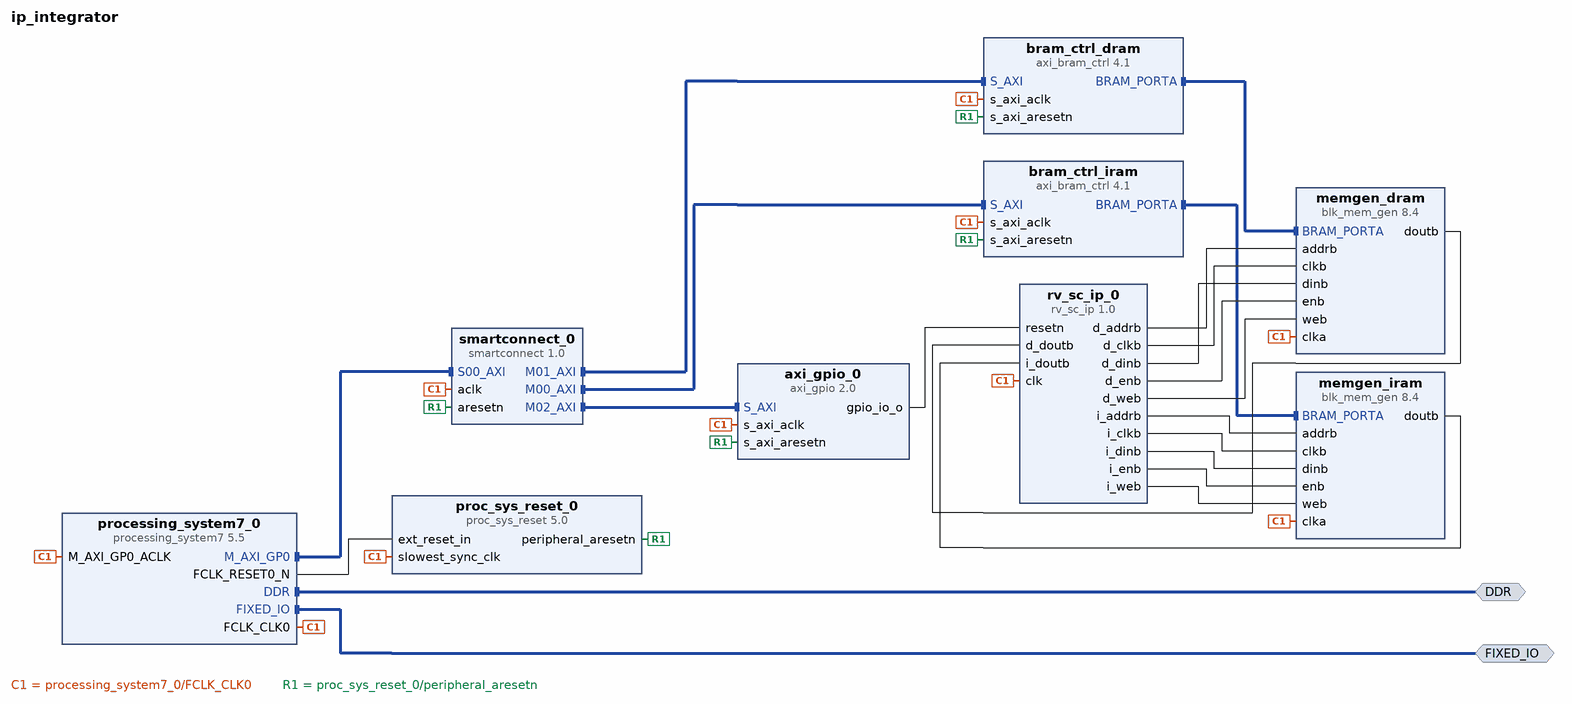
[diagram p0: block diagram of the top level]
# Vivado block design ip_integrator, xc7z020clg400-1, Vivado 2021.2
create_bd_design ip_integrator

create_bd_intf_port -mode Master -vlnv xilinx.com:interface:ddrx_rtl:1.0 DDR
create_bd_intf_port -mode Master -vlnv xilinx.com:display_processing_system7:fixedio_rtl:1.0 FIXED_IO

create_bd_cell -type ip -vlnv xilinx.com:ip:processing_system7:5.5 processing_system7_0
# 2 more settings of processing_system7_0 are not shown: defaults, MIO pin electricals, DDR timing, and values the tool derives
create_bd_cell -type ip -vlnv xilinx.com:ip:smartconnect:1.0 smartconnect_0
set_property -dict {CONFIG.NUM_MI 3 CONFIG.NUM_SI 1} [get_bd_cells smartconnect_0]
create_bd_cell -type ip -vlnv xilinx.com:ip:axi_bram_ctrl:4.1 bram_ctrl_iram
set_property -dict {CONFIG.SINGLE_PORT_BRAM 1} [get_bd_cells bram_ctrl_iram]
create_bd_cell -type ip -vlnv xilinx.com:ip:axi_bram_ctrl:4.1 bram_ctrl_dram
set_property -dict {CONFIG.SINGLE_PORT_BRAM 1} [get_bd_cells bram_ctrl_dram]
create_bd_cell -type ip -vlnv xilinx.com:ip:blk_mem_gen:8.4 memgen_iram
set_property -dict [list \
  CONFIG.Enable_B Use_ENB_Pin \
  CONFIG.Memory_Type True_Dual_Port_RAM \
  CONFIG.Port_B_Clock 100 \
  CONFIG.Port_B_Enable_Rate 100 \
  CONFIG.Port_B_Write_Rate 50 \
  CONFIG.Use_RSTB_Pin true \
] [get_bd_cells memgen_iram]
create_bd_cell -type ip -vlnv xilinx.com:ip:blk_mem_gen:8.4 memgen_dram
set_property -dict [list \
  CONFIG.Enable_B Use_ENB_Pin \
  CONFIG.Memory_Type True_Dual_Port_RAM \
  CONFIG.Port_B_Clock 100 \
  CONFIG.Port_B_Enable_Rate 100 \
  CONFIG.Port_B_Write_Rate 50 \
  CONFIG.Use_RSTB_Pin true \
] [get_bd_cells memgen_dram]
create_bd_cell -type ip -vlnv xilinx.com:ip:axi_gpio:2.0 axi_gpio_0
set_property -dict {CONFIG.C_ALL_INPUTS 0 CONFIG.C_ALL_OUTPUTS 1 CONFIG.C_GPIO_WIDTH 1} [get_bd_cells axi_gpio_0]
create_bd_cell -type ip -vlnv xilinx.com:ip:proc_sys_reset:5.0 proc_sys_reset_0
create_bd_cell -type ip -vlnv xilinx.com:user:rv_sc_ip:1.0 rv_sc_ip_0

# ---- connections ----

connect_bd_intf_net [get_bd_intf_pins memgen_dram/BRAM_PORTA] [get_bd_intf_pins bram_ctrl_dram/BRAM_PORTA]
connect_bd_intf_net [get_bd_intf_pins bram_ctrl_iram/BRAM_PORTA] [get_bd_intf_pins memgen_iram/BRAM_PORTA]
connect_bd_intf_net [get_bd_intf_ports DDR] [get_bd_intf_pins processing_system7_0/DDR]
connect_bd_intf_net [get_bd_intf_ports FIXED_IO] [get_bd_intf_pins processing_system7_0/FIXED_IO]
connect_bd_intf_net [get_bd_intf_pins processing_system7_0/M_AXI_GP0] [get_bd_intf_pins smartconnect_0/S00_AXI]
connect_bd_intf_net [get_bd_intf_pins bram_ctrl_iram/S_AXI] [get_bd_intf_pins smartconnect_0/M00_AXI]
connect_bd_intf_net [get_bd_intf_pins bram_ctrl_dram/S_AXI] [get_bd_intf_pins smartconnect_0/M01_AXI]
connect_bd_intf_net [get_bd_intf_pins axi_gpio_0/S_AXI] [get_bd_intf_pins smartconnect_0/M02_AXI]
connect_bd_net [get_bd_pins processing_system7_0/FCLK_CLK0] \
  [get_bd_pins smartconnect_0/aclk] [get_bd_pins bram_ctrl_iram/s_axi_aclk] [get_bd_pins bram_ctrl_dram/s_axi_aclk] \
  [get_bd_pins axi_gpio_0/s_axi_aclk] [get_bd_pins memgen_iram/clka] [get_bd_pins memgen_dram/clka] \
  [get_bd_pins proc_sys_reset_0/slowest_sync_clk] [get_bd_pins processing_system7_0/M_AXI_GP0_ACLK] \
  [get_bd_pins rv_sc_ip_0/clk]
connect_bd_net [get_bd_pins axi_gpio_0/gpio_io_o] [get_bd_pins rv_sc_ip_0/resetn]
connect_bd_net [get_bd_pins memgen_dram/doutb] [get_bd_pins rv_sc_ip_0/d_doutb]
connect_bd_net [get_bd_pins memgen_iram/doutb] [get_bd_pins rv_sc_ip_0/i_doutb]
connect_bd_net [get_bd_pins proc_sys_reset_0/peripheral_aresetn] \
  [get_bd_pins smartconnect_0/aresetn] [get_bd_pins bram_ctrl_iram/s_axi_aresetn] [get_bd_pins bram_ctrl_dram/s_axi_aresetn] \
  [get_bd_pins axi_gpio_0/s_axi_aresetn]
connect_bd_net [get_bd_pins processing_system7_0/FCLK_RESET0_N] [get_bd_pins proc_sys_reset_0/ext_reset_in]
connect_bd_net [get_bd_pins rv_sc_ip_0/d_addrb] [get_bd_pins memgen_dram/addrb]
connect_bd_net [get_bd_pins rv_sc_ip_0/d_clkb] [get_bd_pins memgen_dram/clkb]
connect_bd_net [get_bd_pins rv_sc_ip_0/d_dinb] [get_bd_pins memgen_dram/dinb]
connect_bd_net [get_bd_pins rv_sc_ip_0/d_enb] [get_bd_pins memgen_dram/enb]
connect_bd_net [get_bd_pins rv_sc_ip_0/d_web] [get_bd_pins memgen_dram/web]
connect_bd_net [get_bd_pins rv_sc_ip_0/i_addrb] [get_bd_pins memgen_iram/addrb]
connect_bd_net [get_bd_pins rv_sc_ip_0/i_clkb] [get_bd_pins memgen_iram/clkb]
connect_bd_net [get_bd_pins rv_sc_ip_0/i_dinb] [get_bd_pins memgen_iram/dinb]
connect_bd_net [get_bd_pins rv_sc_ip_0/i_enb] [get_bd_pins memgen_iram/enb]
connect_bd_net [get_bd_pins rv_sc_ip_0/i_web] [get_bd_pins memgen_iram/web]
set_property HDL_ATTRIBUTE.BMM_INFO_PROCESSOR {arm > ip_integrator bram_ctrl_dram ip_integrator bram_ctrl_iram} [get_bd_cells processing_system7_0]
set_property HDL_ATTRIBUTE.KEEP_HIERARCHY yes [get_bd_cells processing_system7_0]
set_property HDL_ATTRIBUTE.BMM_INFO_ADDRESS_SPACE {byte  0x42000000 32 > ip_integrator memgen_iram} [get_bd_cells bram_ctrl_iram]
set_property HDL_ATTRIBUTE.KEEP_HIERARCHY yes [get_bd_cells bram_ctrl_iram]
set_property HDL_ATTRIBUTE.BMM_INFO_ADDRESS_SPACE {byte  0x40000000 32 > ip_integrator memgen_dram} [get_bd_cells bram_ctrl_dram]
set_property HDL_ATTRIBUTE.KEEP_HIERARCHY yes [get_bd_cells bram_ctrl_dram]

# ---- address map ----
assign_bd_address -offset 0x40000000 -range 8K -target_address_space [get_bd_addr_spaces processing_system7_0/Data] [get_bd_addr_segs bram_ctrl_dram/S_AXI/Mem0]
assign_bd_address -offset 0x41200000 -range 64K -target_address_space [get_bd_addr_spaces processing_system7_0/Data] [get_bd_addr_segs axi_gpio_0/S_AXI/Reg]
assign_bd_address -offset 0x42000000 -range 8K -target_address_space [get_bd_addr_spaces processing_system7_0/Data] [get_bd_addr_segs bram_ctrl_iram/S_AXI/Mem0]

validate_bd_design
save_bd_design
